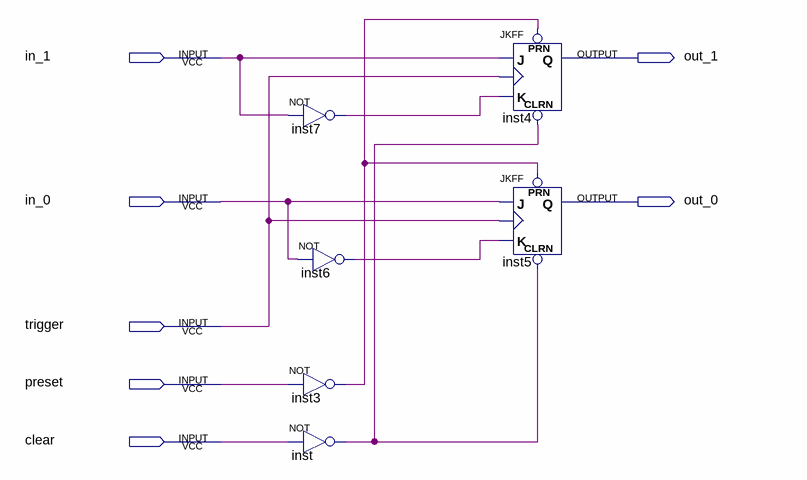
[diagram p0: schematic sheet]
// Quartus schematic Registrador.bdf as structural Verilog: 6 symbols, 7 pins
module Registrador (
  input  in_1,
  input  in_0,
  input  trigger,
  input  preset,
  input  clear,
  output out_1,
  output out_0
);

  wire inst3_out, inst6_out, inst7_out, inst_out;

  not inst7 (inst7_out, in_1);
  not inst6 (inst6_out, in_0);
  not inst3 (inst3_out, preset);
  not inst (inst_out, clear);
  JKFF inst4 (.PRN(inst3_out), .CLRN(inst_out), .K(inst7_out), .J(in_1), .CLK(trigger), .Q(out_1));
  JKFF inst5 (.PRN(inst3_out), .CLRN(inst_out), .K(inst6_out), .J(in_0), .CLK(trigger), .Q(out_0));
endmodule
